# EasyEDA Pro project 4 Port AC Power Switch.eprj, schematic 10A AC Power Switch + Fuse Detect
Board Name: V3.0.0 4 Port Repeat Block; Create Date: 2026-02-09; Page Name: P1; Project Name: AC Power Switch; Schematic Name: 10A AC Power Switch + Fuse Detect; Update Date: 2026-02-10; Company: EasyEDA.com; Page Size: A4; Version: V1.0
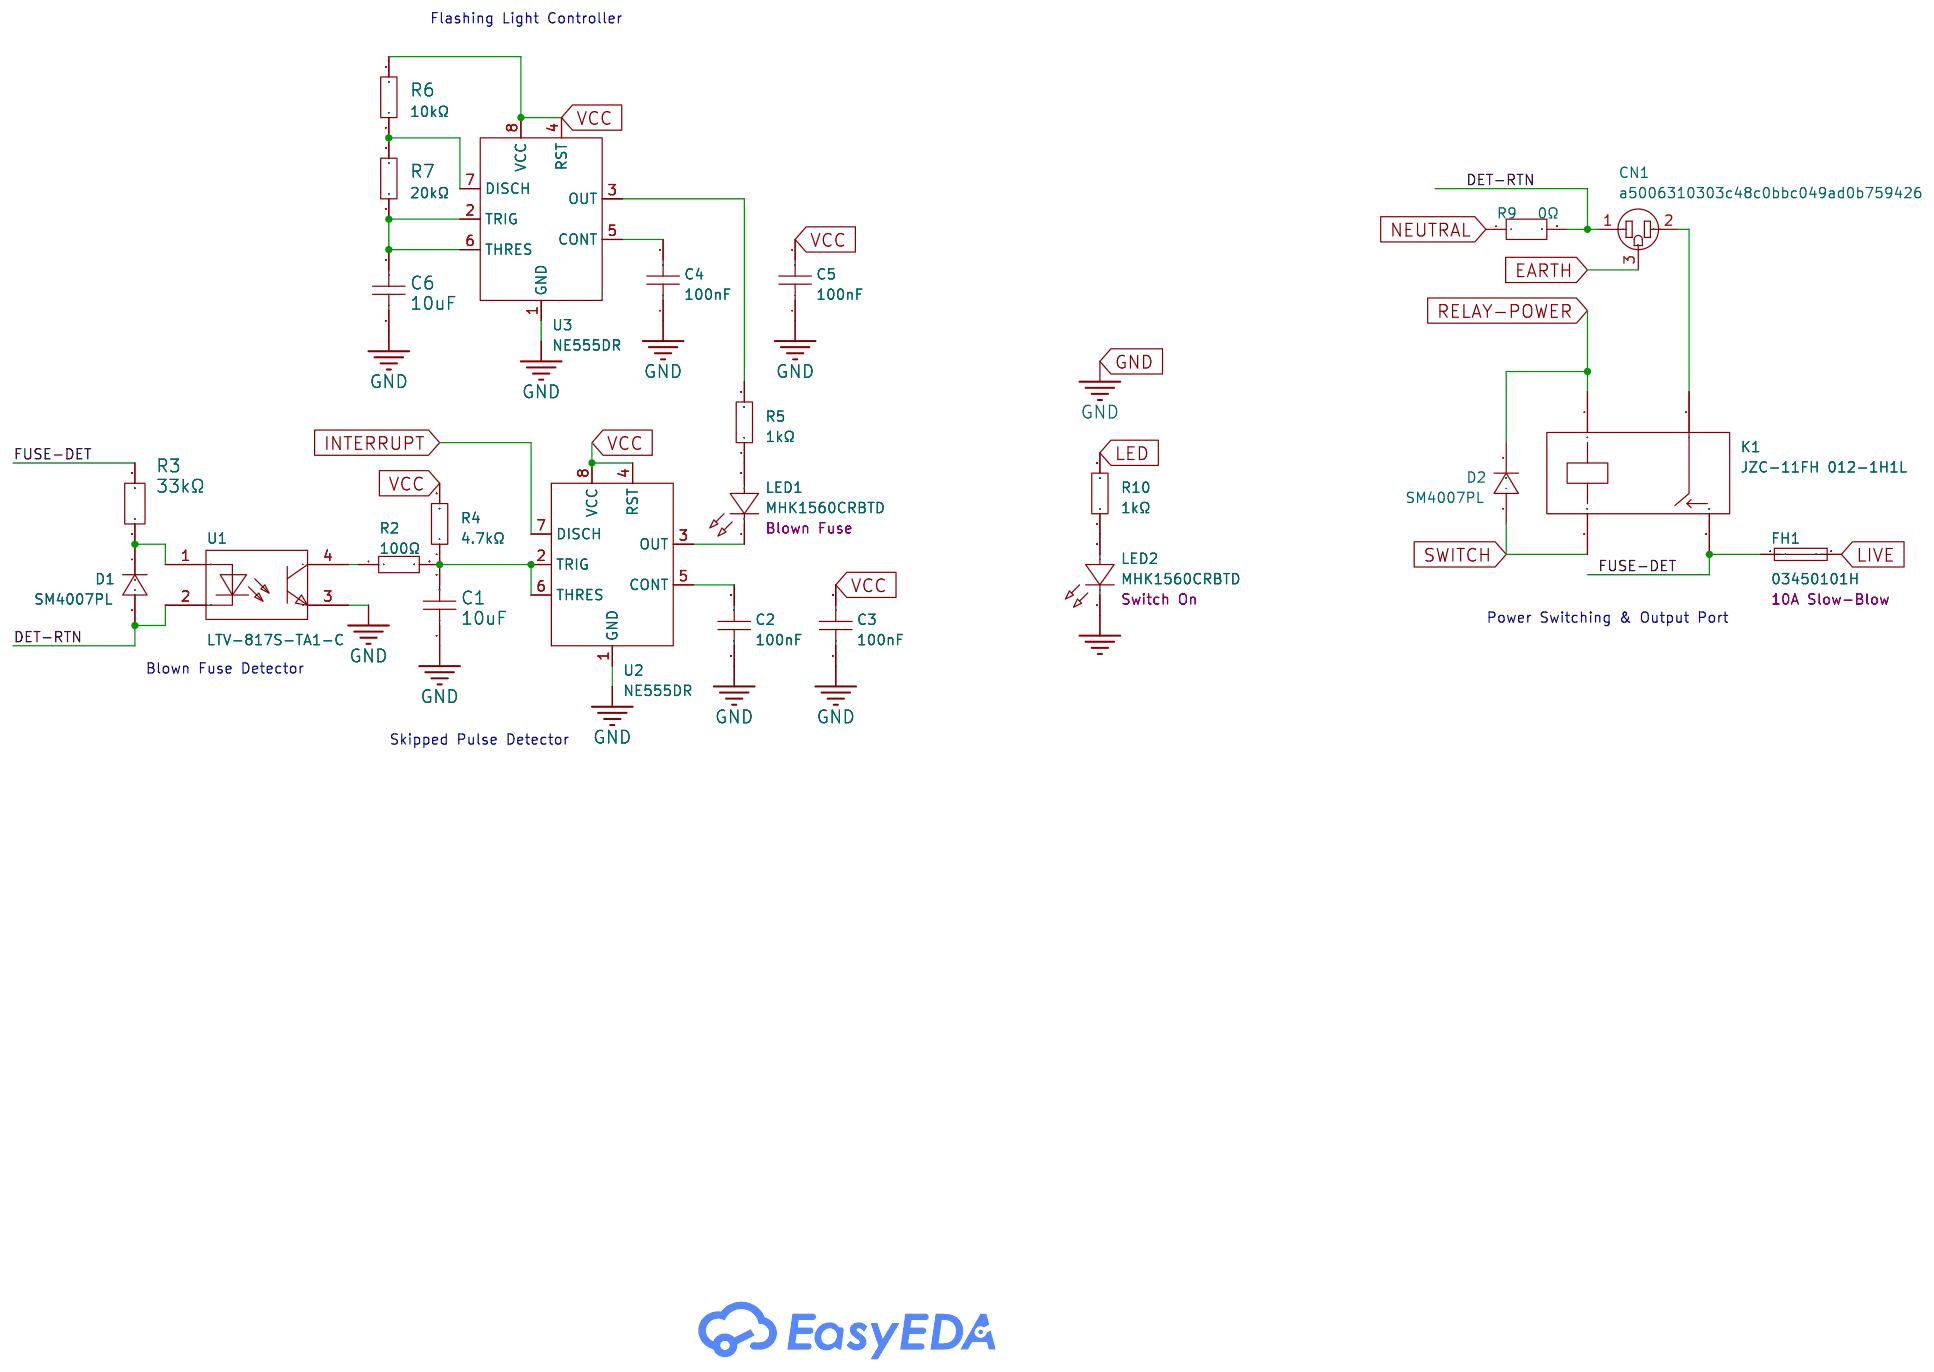
[diagram p2: schematic sheet]

## Parts
C1  10uF  [C0603]
C2  100nF  [C0603]
C3  100nF  [C0603]
C4  100nF  [C0603]
C5  100nF  [C0603]
C6  10uF  [C0603]
CN1  a5006310303c48c0bbc049ad0b759426  [739W-X2/32]
D1  SM4007PL  [SOD-123F_L2.8-W1.8-LS3.7-RD]
D2  SM4007PL  [SOD-123F_L2.8-W1.8-LS3.7-RD]
FH1  03450101H  [03450101H]
K1  JZC-11FH 012-1H1L  [RELAY-TH_QLRELAY_JZC-11FH-XXX-1H1L]
LED1  MHK1560CRBTD  [LED-TH_L12.2-W6.0-P2.54]
LED2  MHK1560CRBTD  [LED-TH_L12.2-W6.0-P2.54]
R2  100Ω  [R0603]
R3  33kΩ  [RES-TH_BD6.0-L17.5-P21.50-D0.8]
R4  4.7kΩ  [R0603]
R5  1kΩ  [R0603]
R6  10kΩ  [R0603]
R7  20kΩ  [R0603]
R9  0Ω  [RES-SMD_L10.2-W1.5_HOTCU-10.2D-0R]
R10  1kΩ  [R0603]
U1  LTV-817S-TA1-C  [OPTO-SMD-4_L4.6-W6.5-P2.54-LS10.3-BL]
U2  NE555DR  [SOIC-8_L4.9-W3.9-P1.27-LS6.0-BL]
U3  NE555DR  [SOIC-8_L4.9-W3.9-P1.27-LS6.0-BL]

## Library data of the parts
C1 C6 = CL10A106MA8NRNC: LCSC Part Name: 10uF ±20% 25V; Supplier Part: C96446; Manufacturer: SAMSUNG(三星); Supplier Footprint: 0603; Datasheet: https://item.szlcsc.com/datasheet/CL10A106MA8NRNC/97651.html; Supplier: LCSC; Tolerance: ±20%; Voltage Rating: 25V; Temperature Coefficient: X5R
C2-C5 = CC0603KRX7R9BB104: LCSC Part Name: 100nF ±10% 50V; Supplier Part: C14663; Manufacturer: YAGEO(国巨); Supplier Footprint: 0603; Datasheet: https://item.szlcsc.com/datasheet/CC0603KRX7R9BB104/15331.html; Supplier: LCSC; Tolerance: ±10%; Voltage Rating: 50V; Temperature Coefficient: X7R
CN1 = 739W-X2/32
D1 D2 = SM4007PL_C64898: LCSC Part Name: 1kV 1A; Supplier Part: C64898; Manufacturer: MDD(辰达半导体); Supplier Footprint: SOD-123FL; Datasheet: https://item.szlcsc.com/datasheet/SM4007PL/65968.html; Supplier: LCSC; Diode Configuration: Independent; Voltage - Forward(Vf@If): 1.1V@1A; Voltage - DC Reverse(Vr): 1kV; Current - Rectified: 1A; Reverse Leakage Current (Ir): 10uA@1kV; Non-Repetitive Peak Forward Surge Current: 25A; Operating Junction Temperature Range: -55℃~+150℃
FH1 = 03450101H: LCSC Part Name: 20A 600V; Supplier Part: C206934; Manufacturer: Littelfuse(美国力特); Datasheet: https://item.szlcsc.com/datasheet/03450101H/208053.html; Supplier: LCSC; Number of Circuits: 1; Voltage Rating: 600V; Current Rating: 20A; Fuse Type: Cylindrical; Fuse Diameter (φD): 6.35mm; Fuse Length: 32mm; Note: 10A Slow-Blow
K1 = JZC-11FH 012-1H1L: LCSC Part Name: 12V 20A 一组常开:1A(单刀单掷-常开); Supplier Part: C22384972; Manufacturer: QLRELAY(群力); Supplier Footprint: 插件,18.4x10.2mm; JLCPCB Part Class: Extended Part; Datasheet: https://item.szlcsc.com/datasheet/JZC-11FH%2520012-1H1L/23933064.html; Supplier: LCSC; Coil Voltage: 12V; Contact Form: 1 Set Normally Open: 1A (SPST NO); Number of Pins: 4; Contact Rating: 20A@125VAC；18A@277VAC; Switching Voltage(Max): 277V@AC; Coil Rated Power: 200mW; Contact Material: Silver Alloy; Switching Current(Max): 20A; Coil Type: Non-Polarized - Single Coil; Coil Resistance: 720Ω; Contact Resistance: 100mΩ; Operate Time: 10ms; Release Time: 10ms; Operating Temperature: -40℃~+85℃
LED1 = MHK1560CRBTD: LCSC Part Name: 1560直插单灯红色光; Supplier Part: C7470835; Manufacturer: MEIHUA(美华); Supplier Footprint: 插件,P=2.54mm; JLCPCB Part Class: Extended Part; Datasheet: https://item.szlcsc.com/datasheet/MHK1560CRBTD/8521940.html; Supplier: LCSC; Illumination Color: Red; Voltage - Forward(Vf): 1.75V~2.2V; Power(Watts): 80mW; Forward Current: 20mA; Wavelength - Dominant: 632nm; Lens Color: Diffused Red Lens; Luminous Intensity: 50mcd; Viewing Angle: 85°; Operating Temperature: -40℃~+85℃; Note: Blown Fuse
LED2 = MHK1560CRBTD: LCSC Part Name: 1560直插单灯红色光; Supplier Part: C7470835; Manufacturer: MEIHUA(美华); Supplier Footprint: 插件,P=2.54mm; JLCPCB Part Class: Extended Part; Datasheet: https://item.szlcsc.com/datasheet/MHK1560CRBTD/8521940.html; Supplier: LCSC; Illumination Color: Red; Voltage - Forward(Vf): 1.75V~2.2V; Power(Watts): 80mW; Forward Current: 20mA; Wavelength - Dominant: 632nm; Lens Color: Diffused Red Lens; Luminous Intensity: 50mcd; Viewing Angle: 85°; Operating Temperature: -40℃~+85℃; Note: Switch On
R2 = 0603WAF1000T5E: LCSC Part Name: 100Ω ±1% 100mW 厚膜电阻; Supplier Part: C22775; Manufacturer: UNI-ROYAL(厚声); Supplier Footprint: 0603; Datasheet: https://atta.szlcsc.com/upload/public/pdf/source/20200306/C422600_1E6D84923E4A46A82E41ADD87F860B5C.pdf; Supplier: LCSC; Type: Thick Film Resistors; Tolerance: ±1%; Temperature Coefficient: ±200ppm/℃; Operating Temperature Range: -55℃~+155℃
R3 = MOR03WJ0333AA0: LCSC Part Name: 33kΩ ±5% 3W; Supplier Part: C7422263; Manufacturer: UNI-ROYAL(厚声); Supplier Footprint: 插件,D6xL17.5mm; Datasheet: https://item.szlcsc.com/datasheet/MOR03WJ0333AA0/8404660.html; Supplier: LCSC; Tolerance: ±5%; Voltage-Supply(Max): 500V; Power(Watts): 3W
R4 = 0603WAF4701T5E: LCSC Part Name: 4.7kΩ ±1% 100mW 厚膜电阻; Supplier Part: C23162; Manufacturer: UNI-ROYAL(厚声); Supplier Footprint: 0603; Datasheet: https://item.szlcsc.com/datasheet/0603WAF4701T5E/23889.html; Supplier: LCSC; Type: Thick Film Resistor; Tolerance: ±1%; Power(Watts): 100mW; Voltage-Supply(Max): 75V; Temperature Coefficient: ±100ppm/℃; Operating Temperature: -55℃~+155℃
R5 R10 = 0603WAF1001T5E: LCSC Part Name: 1kΩ ±1% 100mW 厚膜电阻; Supplier Part: C21190; Manufacturer: UNI-ROYAL(厚声); Supplier Footprint: 0603; Datasheet: https://item.szlcsc.com/datasheet/0603WAF1001T5E/21904.html; Supplier: LCSC; Type: Thick Film Resistor; Tolerance: ±1%; Power(Watts): 100mW; Voltage-Supply(Max): 75V; Temperature Coefficient: ±100ppm/℃; Operating Temperature: -55℃~+155℃
R6 = 0603WAF1002T5E: LCSC Part Name: 厚膜电阻 10kΩ ±1% 100mW; Supplier Part: C25804; Manufacturer: UNI-ROYAL(厚声); Supplier Footprint: 0603; JLCPCB Part Class: Basic Part; Datasheet: https://item.szlcsc.com/datasheet/0603WAF1002T5E/26547.html; Supplier: LCSC; Type: Thick Film Resistor; Tolerance: ±1%; Power(Watts): 100mW; Voltage-Supply(Max): 75V; Temperature Coefficient: ±100ppm/℃; Operating Temperature: -55℃~+155℃
R7 = 0603WAF2002T5E: LCSC Part Name: 20kΩ ±1% 100mW 厚膜电阻; Supplier Part: C4184; Manufacturer: UNI-ROYAL(厚声); Supplier Footprint: 0603; Datasheet: https://item.szlcsc.com/datasheet/0603WAF2002T5E/4591.html; Supplier: LCSC; Type: Thick Film Resistor; Tolerance: ±1%; Power(Watts): 100mW; Voltage-Supply(Max): 75V; Temperature Coefficient: ±100ppm/℃; Operating Temperature: -55℃~+155℃
R9 = HoTCu-10.2D-0R: Resistance:0Ω Tolerance:- Tolerance:- Power(Watts):- Current Rating:20A Mounting Type:SMD; LCSC Part Name: 0Ω 贴片电阻 贴片跳线电阻，塑封电阻; Supplier Part: C5127898; Manufacturer: Milliohm(毫欧); Supplier Footprint: SMD,1.5x10.2mm; JLCPCB Part Class: Extended Part; Datasheet: https://item.szlcsc.com/datasheet/HoTCu-10.2D-0R/5730048.html; Supplier: LCSC; Current Rating: 20A; Mounting Type: SMD
U1 = LTV-817S-TA1-C: LCSC Part Name: DC输入 隔离电压(rms):5000V; Supplier Part: C109227; Manufacturer: LITEON(光宝); Supplier Footprint: SMD-4P; Datasheet: https://item.szlcsc.com/datasheet/LTV-817S-TA1-C/110448.html; Supplier: LCSC; Input type: DC; Output Type: Phototransistor; Voltage - Forward(Vf): 1.2V; Output Current: 50mA; Isolation Voltage(Vrms): 5kV; Reverse Voltage: 6V; Load Voltage: 35V; Number of Outputs: 1; Vce Saturation(VCE(sat)): 100mV@1mA,20mA; Rise time: 4us@2mA,100Ω; Fall time: 3us; Operating Temperature: -30℃~+110℃; Current Transfer Ratio (CTR) Minimum: 50%; Current Transfer Ratio (CTR) Maximum/Saturation Value: 600%; Forward Current(If): 50mA
U2 U3 = NE555DR: Supplier Part: C7593; Manufacturer: TI(德州仪器); Supplier Footprint: SOIC-8; Datasheet: https://www.ti.com/cn/lit/gpn/sa555; Supplier: LCSC

## Nets
GND: C1.1 C2.1 C3.1 C4.1 C5.1 C6.1 LED2.1(K) U1.3 U2.1(GND) U3.1(GND)
VCC: C3.2 C5.2 R4.2 R6.2 U2.4(RST) U2.8(VCC) U3.4(RST) U3.8(VCC)
DET-RTN: CN1.1 D1.2(A) R9.2 U1.2
EARTH: CN1.3
FUSE-DET: FH1.2 K1.3 R3.2
INTERRUPT: U2.7(DISCH)
LED: R10.2
LIVE: FH1.1
NEUTRAL: R9.1
RELAY-POWER: D2.1(C) K1.1
SWITCH: D2.2(A) K1.2
$1N254: CN1.2 K1.4
$1N1155: C2.2 U2.5(CONT)
$1N1159: C1.2 R2.2 R4.1 U2.2(TRIG) U2.6(THRES)
$1N1161: LED1.1(K) U2.3(OUT)
$1N1162: LED1.2(A) R5.1
$1N1169: C4.2 U3.5(CONT)
$1N1170: C6.2 R7.1 U3.2(TRIG) U3.6(THRES)
$1N1173: R2.1 U1.4
$1N1174: R5.2 U3.3(OUT)
$1N1176: R6.1 R7.2 U3.7(DISCH)
$1N1181: D1.1(C) R3.1 U1.1
$1N3824: LED2.2(A) R10.1

## Notes on the sheet
- Flashing Light Controller
- Power Switching & Output Port
- Blown Fuse Detector
- Skipped Pulse Detector
